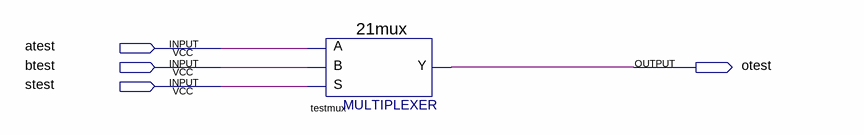
[diagram p0: schematic sheet]
// Quartus schematic reg.bdf as structural Verilog: 1 symbols, 4 pins
module \reg  (
  input  atest,
  input  btest,
  input  stest,
  output otest
);

  \21mux  testmux (.S(stest), .B(btest), .A(atest), .Y(otest));
endmodule
